# Altium schematic sheet MIDI.SchDoc
size A; SheetNumber: 5; SheetTotal: 7
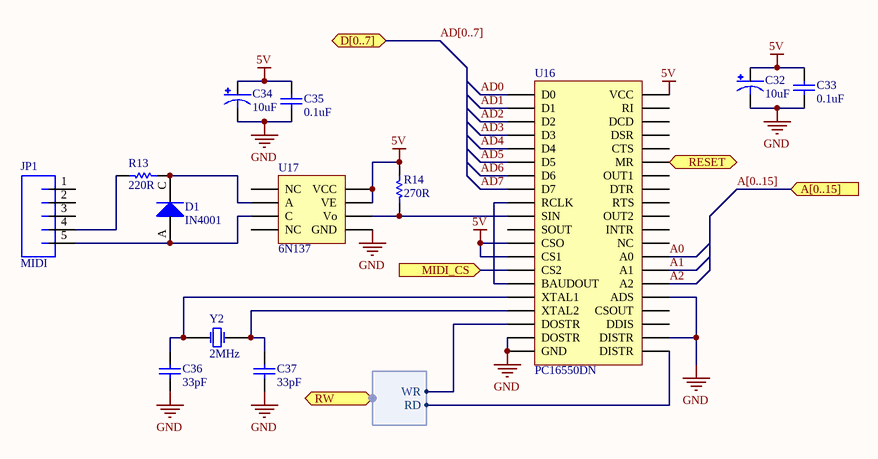
[diagram p0: MIDI.SchDoc]

## Parts
C32  10uF  [CPOL-RADIAL]
C33  0.1uF  [CAP-PTH]
C34  10uF  [CPOL-RADIAL]
C35  0.1uF  [CAP-PTH]
C36  33pF  [CAP-PTH]
C37  33pF  [CAP-PTH]
D1  IN4001  [DIODE-1N4001]
JP1  MIDI  [DIN_5_FEMALE]
R13  220R  [RESISTOR]
R14  270R  [RESISTOR]
U16  PC16550DN  [PDIP-40]
U17  6N137  [PDIP-8]
Y2  2MHz  [CRYSTAL_PTH]

## Ports
A[0..15] (in), D[0..7] (bidir), MIDI_CS (in), RESET (in), RW (harness RW)

## Harnesses
RW: WR, RD

## Nets
5V: C32.1(+) C33.1 C34.1(+) C35.1 R14.2 U16.12(CSO) U16.13(CS1) U16.40(VCC) U17.7(VE) U17.8(VCC)
GND: C32.2(-) C33.2 C34.2(-) C35.2 C36.2 C37.2 U16.19(DOSTR) U16.20(GND) U16.22(DISTR) U16.25(ADS) U17.5(GND)
A0: U16.28(A0)
A1: U16.27(A1)
A2: U16.26(A2)
AD0: U16.1(D0)
AD1: U16.2(D1)
AD2: U16.3(D2)
AD3: U16.4(D3)
AD4: U16.5(D4)
AD5: U16.6(D5)
AD6: U16.7(D6)
AD7: U16.8(D7)
MIDI_CS: U16.14(CS2) ; port MIDI_CS
RESET: U16.35(MR) ; port RESET
NetC36_1: C36.1 U16.16(XTAL1) Y2.1(X1)
NetC37_1: C37.1 U16.17(XTAL2) Y2.2(X2)
NetD1_A: D1.A JP1.5 U17.3(C)
NetD1_C: D1.C(K) R13.2 U17.2(A)
NetJP1_4: JP1.4 R13.1
NetR14_1: R14.1 U16.10(SIN) U17.6(Vo)
NetU16_9: U16.9(RCLK) U16.15(BAUDOUT)
NetU16_18: U16.18(DOSTR) ; port RW.WR
NetU16_21: U16.21(DISTR) ; port RW.RD

Not connected (* = marked no-connect by the designer): JP1 1 2 3; U16 11(SOUT) 23(DDIS) 24(CSOUT) 29(NC) 30(INTR) 31(OUT2) 32(RTS) 33(DTR) 34(OUT1) 36(CTS) 37(DSR) 38(DCD) 39(RI); U17 1(NC) 4(NC)

## Buses and harness runs
bus A[0..15] = port A[0..15]
bus AD[0..7] = port D[0..7]

## Library data of the parts
C32 C34 = PolarizedCap
C33 C35-C37 = Cap
R13 R14 = Resistor
U16 = PC16550DN: Manufacturer: Texas Instruments; PartNumber: PC16550DN; Mounting Technology: Through Hole; PackageReference: PDIP-40
Y2 = Crystal